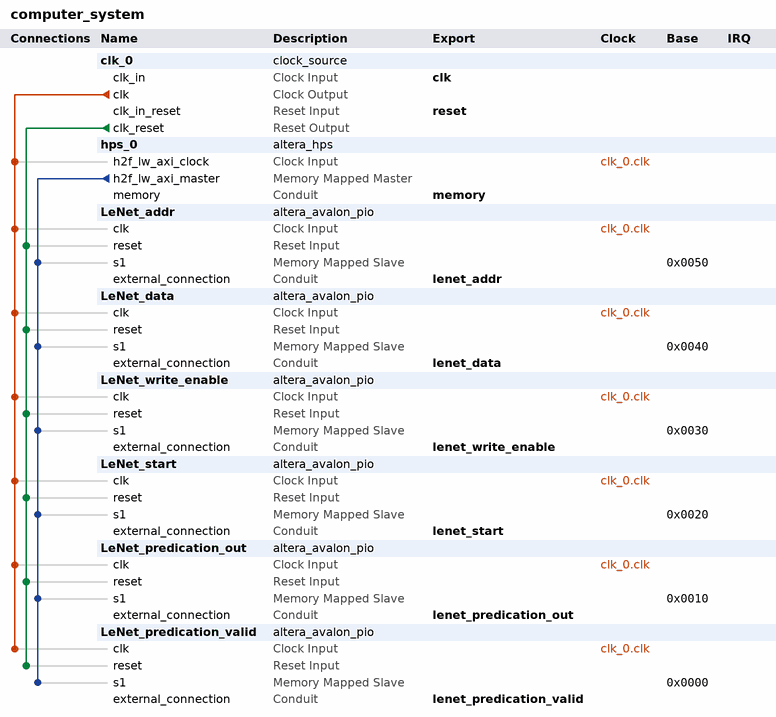
[diagram p0: system contents]
# Platform Designer (Qsys) system computer_system, Cyclone V 5CSEMA5F31C6
# Parameters at their usual value, and those the tool derives, are not listed.
package require -exact qsys 18.1
create_system computer_system
set_project_property DEVICE_FAMILY {Cyclone V}
set_project_property DEVICE 5CSEMA5F31C6

add_instance clk_0 clock_source 18.1
set_instance_parameter_value clk_0 clockFrequency 50000000

add_instance hps_0 altera_hps 18.1
set_instance_parameter_value hps_0 EMAC1_Mode N/A
set_instance_parameter_value hps_0 EMAC1_PinMuxing Unused
set_instance_parameter_value hps_0 F2SCLK_COLDRST_Enable false
set_instance_parameter_value hps_0 F2SCLK_DBGRST_Enable false
set_instance_parameter_value hps_0 F2SCLK_WARMRST_Enable false
set_instance_parameter_value hps_0 F2SINTERRUPT_Enable false
set_instance_parameter_value hps_0 F2S_Width 0
set_instance_parameter_value hps_0 FPGA_PERIPHERAL_OUTPUT_CLOCK_FREQ_EMAC0_GTX_CLK 100
set_instance_parameter_value hps_0 FPGA_PERIPHERAL_OUTPUT_CLOCK_FREQ_EMAC0_MD_CLK 100.0
set_instance_parameter_value hps_0 FPGA_PERIPHERAL_OUTPUT_CLOCK_FREQ_EMAC1_GTX_CLK 100
set_instance_parameter_value hps_0 FPGA_PERIPHERAL_OUTPUT_CLOCK_FREQ_EMAC1_MD_CLK 100.0
set_instance_parameter_value hps_0 HPS_PROTOCOL DDR3
set_instance_parameter_value hps_0 I2C0_Mode N/A
set_instance_parameter_value hps_0 I2C0_PinMuxing Unused
set_instance_parameter_value hps_0 I2C1_Mode N/A
set_instance_parameter_value hps_0 I2C1_PinMuxing Unused
set_instance_parameter_value hps_0 LWH2F_Enable true
set_instance_parameter_value hps_0 MEM_BANKADDR_WIDTH 3
set_instance_parameter_value hps_0 MEM_CLK_FREQ 400.0
set_instance_parameter_value hps_0 MEM_COL_ADDR_WIDTH 10
set_instance_parameter_value hps_0 MEM_DQ_WIDTH 32
set_instance_parameter_value hps_0 MEM_DRV_STR RZQ/7
set_instance_parameter_value hps_0 MEM_ROW_ADDR_WIDTH 15
set_instance_parameter_value hps_0 MEM_RTT_NOM RZQ/4
set_instance_parameter_value hps_0 MEM_RTT_WR RZQ/4
set_instance_parameter_value hps_0 MEM_TCL 11
set_instance_parameter_value hps_0 MEM_TFAW_NS 30.0
set_instance_parameter_value hps_0 MEM_TRAS_NS 35.0
set_instance_parameter_value hps_0 MEM_TRCD_NS 13.75
set_instance_parameter_value hps_0 MEM_TRFC_NS 260.0
set_instance_parameter_value hps_0 MEM_TRP_NS 13.75
set_instance_parameter_value hps_0 MEM_VENDOR JEDEC
set_instance_parameter_value hps_0 MEM_WTCL 8
set_instance_parameter_value hps_0 QSPI_Mode N/A
set_instance_parameter_value hps_0 QSPI_PinMuxing Unused
set_instance_parameter_value hps_0 REF_CLK_FREQ 25.0
set_instance_parameter_value hps_0 S2FCLK_USER2CLK 5
set_instance_parameter_value hps_0 S2F_Width 0
set_instance_parameter_value hps_0 SDIO_Mode N/A
set_instance_parameter_value hps_0 SDIO_PinMuxing Unused
set_instance_parameter_value hps_0 SPIM1_Mode N/A
set_instance_parameter_value hps_0 SPIM1_PinMuxing Unused
set_instance_parameter_value hps_0 STM_Enable false
set_instance_parameter_value hps_0 TIMING_BOARD_AC_SKEW 0.03
set_instance_parameter_value hps_0 TIMING_BOARD_AC_TO_CK_SKEW 0.0
set_instance_parameter_value hps_0 TIMING_BOARD_DQ_TO_DQS_SKEW 0.0
set_instance_parameter_value hps_0 TIMING_BOARD_MAX_CK_DELAY 0.03
set_instance_parameter_value hps_0 TIMING_BOARD_MAX_DQS_DELAY 0.02
set_instance_parameter_value hps_0 TIMING_BOARD_SKEW_BETWEEN_DQS 0.08
set_instance_parameter_value hps_0 TIMING_BOARD_SKEW_CKDQS_DIMM_MAX 0.16
set_instance_parameter_value hps_0 TIMING_BOARD_SKEW_CKDQS_DIMM_MIN 0.09
set_instance_parameter_value hps_0 TIMING_BOARD_SKEW_WITHIN_DQS 0.01
set_instance_parameter_value hps_0 TIMING_TDH 65
set_instance_parameter_value hps_0 TIMING_TDQSCK 255
set_instance_parameter_value hps_0 TIMING_TDQSQ 125
set_instance_parameter_value hps_0 TIMING_TDS 30
set_instance_parameter_value hps_0 TIMING_TIH 140
set_instance_parameter_value hps_0 TIMING_TIS 180
set_instance_parameter_value hps_0 TIMING_TQSH 0.4
set_instance_parameter_value hps_0 UART0_Mode N/A
set_instance_parameter_value hps_0 UART0_PinMuxing Unused
set_instance_parameter_value hps_0 USB1_Mode N/A
set_instance_parameter_value hps_0 USB1_PinMuxing Unused
set_instance_parameter_value hps_0 desired_cfg_clk_mhz 100.0
set_instance_parameter_value hps_0 desired_qspi_clk_mhz 400.0

add_instance LeNet_addr altera_avalon_pio 18.1
set_instance_parameter_value LeNet_addr direction Output
set_instance_parameter_value LeNet_addr width 8

add_instance LeNet_data altera_avalon_pio 18.1
set_instance_parameter_value LeNet_data direction Output
set_instance_parameter_value LeNet_data width 8

add_instance LeNet_write_enable altera_avalon_pio 18.1
set_instance_parameter_value LeNet_write_enable direction Output
set_instance_parameter_value LeNet_write_enable width 1

add_instance LeNet_start altera_avalon_pio 18.1
set_instance_parameter_value LeNet_start direction Output
set_instance_parameter_value LeNet_start width 1

add_instance LeNet_predication_out altera_avalon_pio 18.1
set_instance_parameter_value LeNet_predication_out captureEdge true
set_instance_parameter_value LeNet_predication_out direction Input
set_instance_parameter_value LeNet_predication_out width 10

add_instance LeNet_predication_valid altera_avalon_pio 18.1
set_instance_parameter_value LeNet_predication_valid captureEdge true
set_instance_parameter_value LeNet_predication_valid direction Input
set_instance_parameter_value LeNet_predication_valid width 1

# connections
add_connection clk_0.clk hps_0.h2f_lw_axi_clock clock
add_connection clk_0.clk LeNet_addr.clk clock
add_connection clk_0.clk LeNet_data.clk clock
add_connection clk_0.clk LeNet_predication_out.clk clock
add_connection clk_0.clk LeNet_predication_valid.clk clock
add_connection clk_0.clk LeNet_start.clk clock
add_connection clk_0.clk LeNet_write_enable.clk clock
add_connection clk_0.clk_reset LeNet_addr.reset reset
add_connection clk_0.clk_reset LeNet_data.reset reset
add_connection clk_0.clk_reset LeNet_predication_out.reset reset
add_connection clk_0.clk_reset LeNet_predication_valid.reset reset
add_connection clk_0.clk_reset LeNet_start.reset reset
add_connection clk_0.clk_reset LeNet_write_enable.reset reset
add_connection hps_0.h2f_lw_axi_master LeNet_addr.s1 avalon
set_connection_parameter_value hps_0.h2f_lw_axi_master/LeNet_addr.s1 baseAddress 0x0050
add_connection hps_0.h2f_lw_axi_master LeNet_data.s1 avalon
set_connection_parameter_value hps_0.h2f_lw_axi_master/LeNet_data.s1 baseAddress 0x0040
add_connection hps_0.h2f_lw_axi_master LeNet_predication_out.s1 avalon
set_connection_parameter_value hps_0.h2f_lw_axi_master/LeNet_predication_out.s1 baseAddress 0x0010
add_connection hps_0.h2f_lw_axi_master LeNet_predication_valid.s1 avalon
set_connection_parameter_value hps_0.h2f_lw_axi_master/LeNet_predication_valid.s1 baseAddress 0x0000
add_connection hps_0.h2f_lw_axi_master LeNet_start.s1 avalon
set_connection_parameter_value hps_0.h2f_lw_axi_master/LeNet_start.s1 baseAddress 0x0020
add_connection hps_0.h2f_lw_axi_master LeNet_write_enable.s1 avalon
set_connection_parameter_value hps_0.h2f_lw_axi_master/LeNet_write_enable.s1 baseAddress 0x0030

# exported interfaces
add_interface clk clock sink
set_interface_property clk EXPORT_OF clk_0.clk_in
add_interface lenet_addr conduit end
set_interface_property lenet_addr EXPORT_OF LeNet_addr.external_connection
add_interface lenet_data conduit end
set_interface_property lenet_data EXPORT_OF LeNet_data.external_connection
add_interface lenet_predication_out conduit end
set_interface_property lenet_predication_out EXPORT_OF LeNet_predication_out.external_connection
add_interface lenet_predication_valid conduit end
set_interface_property lenet_predication_valid EXPORT_OF LeNet_predication_valid.external_connection
add_interface lenet_start conduit end
set_interface_property lenet_start EXPORT_OF LeNet_start.external_connection
add_interface lenet_write_enable conduit end
set_interface_property lenet_write_enable EXPORT_OF LeNet_write_enable.external_connection
add_interface memory conduit end
set_interface_property memory EXPORT_OF hps_0.memory
add_interface reset reset sink
set_interface_property reset EXPORT_OF clk_0.clk_in_reset

set_interconnect_requirement {$system} qsys_mm.clockCrossingAdapter HANDSHAKE
set_interconnect_requirement {$system} qsys_mm.enableEccProtection FALSE
set_interconnect_requirement {$system} qsys_mm.insertDefaultSlave FALSE
set_interconnect_requirement {$system} qsys_mm.maxAdditionalLatency 1

save_system computer_system.qsys
